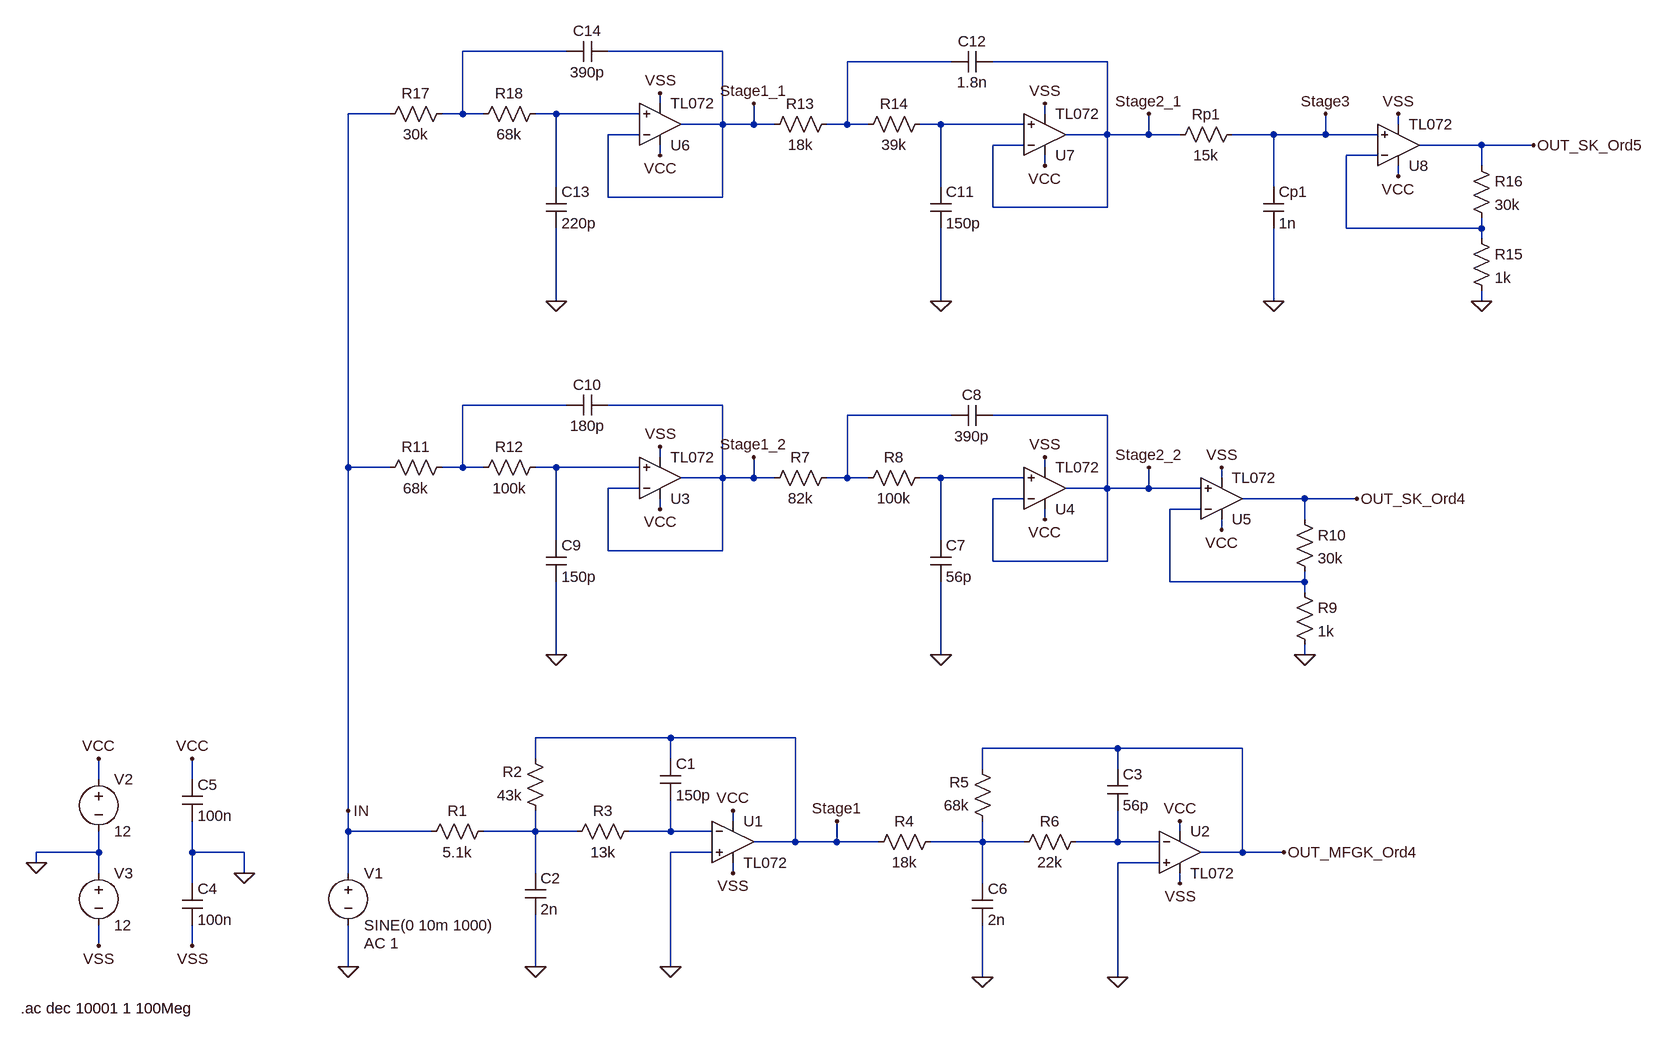
[diagram p0: schematic MFGK_SK_ordnung4_10kHz_1dB_30dB_butter.asc]
MFGK_SK_ordnung4_10kHz_1dB_30dB_butter.asc, the LTspice schematic file:
Version 4
SHEET 1 1784 736
WIRE 112 -928 -48 -928
WIRE 352 -928 176 -928
WIRE 704 -912 544 -912
WIRE 944 -912 768 -912
WIRE 256 -848 256 -864
WIRE -160 -832 -224 -832
WIRE -48 -832 -48 -928
WIRE -48 -832 -80 -832
WIRE -16 -832 -48 -832
WIRE 96 -832 64 -832
WIRE 224 -832 96 -832
WIRE 848 -832 848 -848
WIRE 352 -816 352 -928
WIRE 352 -816 288 -816
WIRE 400 -816 400 -848
WIRE 400 -816 352 -816
WIRE 432 -816 400 -816
WIRE 544 -816 544 -912
WIRE 544 -816 512 -816
WIRE 576 -816 544 -816
WIRE 688 -816 656 -816
WIRE 816 -816 688 -816
WIRE 1392 -816 1392 -832
WIRE 224 -800 176 -800
WIRE 944 -800 944 -912
WIRE 944 -800 880 -800
WIRE 1008 -800 1008 -832
WIRE 1008 -800 944 -800
WIRE 1056 -800 1008 -800
WIRE 1200 -800 1136 -800
WIRE 1280 -800 1280 -832
WIRE 1280 -800 1200 -800
WIRE 1360 -800 1280 -800
WIRE 816 -784 768 -784
WIRE 1520 -784 1424 -784
WIRE 1600 -784 1520 -784
WIRE 256 -768 256 -784
WIRE 1360 -768 1312 -768
WIRE 848 -752 848 -768
WIRE 1520 -752 1520 -784
WIRE 1392 -736 1392 -752
WIRE 96 -720 96 -832
WIRE 688 -720 688 -816
WIRE 1200 -720 1200 -800
WIRE 176 -704 176 -800
WIRE 352 -704 352 -816
WIRE 352 -704 176 -704
WIRE 768 -688 768 -784
WIRE 944 -688 944 -800
WIRE 944 -688 768 -688
WIRE 1312 -656 1312 -768
WIRE 1520 -656 1520 -672
WIRE 1520 -656 1312 -656
WIRE 1520 -640 1520 -656
WIRE 96 -544 96 -656
WIRE 688 -544 688 -656
WIRE 1200 -544 1200 -656
WIRE 1520 -544 1520 -560
WIRE 112 -384 -48 -384
WIRE 352 -384 176 -384
WIRE 704 -368 544 -368
WIRE 944 -368 768 -368
WIRE 256 -304 256 -320
WIRE -224 -288 -224 -832
WIRE -160 -288 -224 -288
WIRE -48 -288 -48 -384
WIRE -48 -288 -80 -288
WIRE -16 -288 -48 -288
WIRE 96 -288 64 -288
WIRE 224 -288 96 -288
WIRE 848 -288 848 -304
WIRE 352 -272 352 -384
WIRE 352 -272 288 -272
WIRE 400 -272 400 -304
WIRE 400 -272 352 -272
WIRE 432 -272 400 -272
WIRE 544 -272 544 -368
WIRE 544 -272 512 -272
WIRE 576 -272 544 -272
WIRE 688 -272 656 -272
WIRE 816 -272 688 -272
WIRE 1120 -272 1120 -288
WIRE 224 -256 176 -256
WIRE 944 -256 944 -368
WIRE 944 -256 880 -256
WIRE 1008 -256 1008 -288
WIRE 1008 -256 944 -256
WIRE 1088 -256 1008 -256
WIRE 816 -240 768 -240
WIRE 1248 -240 1152 -240
WIRE 1328 -240 1248 -240
WIRE 256 -224 256 -240
WIRE 1088 -224 1040 -224
WIRE 848 -208 848 -224
WIRE 1248 -208 1248 -240
WIRE 1120 -192 1120 -208
WIRE 96 -176 96 -288
WIRE 688 -176 688 -272
WIRE 176 -160 176 -256
WIRE 352 -160 352 -272
WIRE 352 -160 176 -160
WIRE 768 -144 768 -240
WIRE 944 -144 944 -256
WIRE 944 -144 768 -144
WIRE 1040 -112 1040 -224
WIRE 1248 -112 1248 -128
WIRE 1248 -112 1040 -112
WIRE 1248 -96 1248 -112
WIRE 96 0 96 -112
WIRE 688 0 688 -112
WIRE 1248 0 1248 -16
WIRE 272 128 64 128
WIRE 464 128 272 128
WIRE 960 144 752 144
WIRE 1152 144 960 144
WIRE 64 160 64 128
WIRE 272 160 272 128
WIRE 752 176 752 144
WIRE 960 176 960 144
WIRE -608 192 -608 160
WIRE -464 192 -464 160
WIRE -224 240 -224 -288
WIRE 368 256 368 240
WIRE -224 272 -224 240
WIRE -96 272 -224 272
WIRE 64 272 64 240
WIRE 64 272 -16 272
WIRE 128 272 64 272
WIRE 272 272 272 224
WIRE 272 272 208 272
WIRE 336 272 272 272
WIRE 1056 272 1056 256
WIRE 464 288 464 128
WIRE 464 288 400 288
WIRE 528 288 528 256
WIRE 528 288 464 288
WIRE 592 288 528 288
WIRE 752 288 752 256
WIRE 752 288 672 288
WIRE 816 288 752 288
WIRE 960 288 960 240
WIRE 960 288 896 288
WIRE 1024 288 960 288
WIRE -608 304 -608 272
WIRE -608 304 -704 304
WIRE -464 304 -464 256
WIRE -384 304 -464 304
WIRE 336 304 272 304
WIRE 1152 304 1152 144
WIRE 1152 304 1088 304
WIRE 1216 304 1152 304
WIRE -704 320 -704 304
WIRE 1024 320 960 320
WIRE -608 336 -608 304
WIRE -384 336 -384 304
WIRE -224 336 -224 272
WIRE 64 336 64 272
WIRE 368 336 368 320
WIRE -464 352 -464 304
WIRE 752 352 752 288
WIRE 1056 352 1056 336
WIRE -608 448 -608 416
WIRE -464 448 -464 416
WIRE -224 480 -224 416
WIRE 64 480 64 400
WIRE 272 480 272 304
WIRE 752 496 752 416
WIRE 960 496 960 320
FLAG -608 160 VCC
FLAG -608 448 VSS
FLAG -704 320 0
FLAG -464 160 VCC
FLAG -464 448 VSS
FLAG -384 336 0
FLAG -224 480 0
FLAG -224 240 IN
FLAG 1248 0 0
FLAG 688 0 0
FLAG 96 0 0
FLAG 256 -320 VSS
FLAG 848 -304 VSS
FLAG 1120 -288 VSS
FLAG 256 -224 VCC
FLAG 848 -208 VCC
FLAG 1120 -192 VCC
FLAG 1328 -240 OUT_SK_Ord4
FLAG 1008 -288 Stage2_2
FLAG 400 -304 Stage1_2
FLAG 1520 -544 0
FLAG 688 -544 0
FLAG 96 -544 0
FLAG 256 -864 VSS
FLAG 848 -848 VSS
FLAG 1392 -832 VSS
FLAG 256 -768 VCC
FLAG 848 -752 VCC
FLAG 1392 -736 VCC
FLAG 1600 -784 OUT_SK_Ord5
FLAG 1008 -832 Stage2_1
FLAG 400 -848 Stage1_1
FLAG 1200 -544 0
FLAG 1280 -832 Stage3
FLAG 368 240 VCC
FLAG 368 336 VSS
FLAG 272 480 0
FLAG 64 480 0
FLAG 528 256 Stage1
FLAG 1056 256 VCC
FLAG 1056 352 VSS
FLAG 960 496 0
FLAG 752 496 0
FLAG 1216 304 OUT_MFGK_Ord4
SYMBOL voltage -224 320 R0
WINDOW 123 24 124 Left 2
WINDOW 39 0 0 Left 0
SYMATTR Value2 AC 1
SYMATTR InstName V1
SYMATTR Value SINE(0 10m 1000)
SYMBOL voltage -608 176 R0
WINDOW 123 0 0 Left 0
WINDOW 39 0 0 Left 0
SYMATTR InstName V2
SYMATTR Value 12
SYMBOL voltage -608 320 R0
WINDOW 123 0 0 Left 0
WINDOW 39 0 0 Left 0
SYMATTR InstName V3
SYMATTR Value 12
SYMBOL cap -480 192 R0
SYMATTR InstName C5
SYMATTR Value 100n
SYMBOL cap -480 352 R0
SYMATTR InstName C4
SYMATTR Value 100n
SYMBOL res 528 -288 R90
WINDOW 0 0 56 VBottom 2
WINDOW 3 32 56 VTop 2
SYMATTR InstName R7
SYMATTR Value 82k
SYMBOL res 672 -288 R90
WINDOW 0 0 56 VBottom 2
WINDOW 3 32 56 VTop 2
SYMATTR InstName R8
SYMATTR Value 100k
SYMBOL res 1232 -112 R0
SYMATTR InstName R9
SYMATTR Value 1k
SYMBOL res 1232 -224 R0
SYMATTR InstName R10
SYMATTR Value 30k
SYMBOL cap 672 -176 R0
SYMATTR InstName C7
SYMATTR Value 56p
SYMBOL cap 768 -384 R90
WINDOW 0 0 32 VBottom 2
WINDOW 3 32 32 VTop 2
SYMATTR InstName C8
SYMATTR Value 390p
SYMBOL res -64 -304 R90
WINDOW 0 0 56 VBottom 2
WINDOW 3 32 56 VTop 2
SYMATTR InstName R11
SYMATTR Value 68k
SYMBOL res 80 -304 R90
WINDOW 0 0 56 VBottom 2
WINDOW 3 32 56 VTop 2
SYMATTR InstName R12
SYMATTR Value 100k
SYMBOL cap 80 -176 R0
SYMATTR InstName C9
SYMATTR Value 150p
SYMBOL cap 176 -400 R90
WINDOW 0 0 32 VBottom 2
WINDOW 3 32 32 VTop 2
SYMATTR InstName C10
SYMATTR Value 180p
SYMBOL TL072 256 -208 M180
SYMATTR InstName U3
SYMBOL TL072 848 -192 M180
SYMATTR InstName U4
SYMBOL TL072 1120 -176 M180
SYMATTR InstName U5
SYMBOL res 528 -832 R90
WINDOW 0 0 56 VBottom 2
WINDOW 3 32 56 VTop 2
SYMATTR InstName R13
SYMATTR Value 18k
SYMBOL res 672 -832 R90
WINDOW 0 0 56 VBottom 2
WINDOW 3 32 56 VTop 2
SYMATTR InstName R14
SYMATTR Value 39k
SYMBOL res 1504 -656 R0
SYMATTR InstName R15
SYMATTR Value 1k
SYMBOL res 1504 -768 R0
SYMATTR InstName R16
SYMATTR Value 30k
SYMBOL cap 672 -720 R0
SYMATTR InstName C11
SYMATTR Value 150p
SYMBOL cap 768 -928 R90
WINDOW 0 0 32 VBottom 2
WINDOW 3 32 32 VTop 2
SYMATTR InstName C12
SYMATTR Value 1.8n
SYMBOL res -64 -848 R90
WINDOW 0 0 56 VBottom 2
WINDOW 3 32 56 VTop 2
SYMATTR InstName R17
SYMATTR Value 30k
SYMBOL res 80 -848 R90
WINDOW 0 0 56 VBottom 2
WINDOW 3 32 56 VTop 2
SYMATTR InstName R18
SYMATTR Value 68k
SYMBOL cap 80 -720 R0
SYMATTR InstName C13
SYMATTR Value 220p
SYMBOL cap 176 -944 R90
WINDOW 0 0 32 VBottom 2
WINDOW 3 32 32 VTop 2
SYMATTR InstName C14
SYMATTR Value 390p
SYMBOL TL072 256 -752 M180
SYMATTR InstName U6
SYMBOL TL072 848 -736 M180
SYMATTR InstName U7
SYMBOL TL072 1392 -720 M180
SYMATTR InstName U8
SYMBOL res 1152 -816 R90
WINDOW 0 0 56 VBottom 2
WINDOW 3 32 56 VTop 2
SYMATTR InstName Rp1
SYMATTR Value 15k
SYMBOL cap 1184 -720 R0
SYMATTR InstName Cp1
SYMATTR Value 1n
SYMBOL res 0 256 R90
WINDOW 0 0 56 VBottom 2
WINDOW 3 32 56 VTop 2
SYMATTR InstName R1
SYMATTR Value 5.1k
SYMBOL res 80 256 R180
WINDOW 0 36 76 Left 2
WINDOW 3 36 40 Left 2
SYMATTR InstName R2
SYMATTR Value 43k
SYMBOL res 112 288 R270
WINDOW 0 32 56 VTop 2
WINDOW 3 0 56 VBottom 2
SYMATTR InstName R3
SYMATTR Value 13k
SYMBOL cap 256 160 R0
SYMATTR InstName C1
SYMATTR Value 150p
SYMBOL cap 48 336 R0
SYMATTR InstName C2
SYMATTR Value 2n
SYMBOL TL072 368 224 R0
SYMATTR InstName U1
SYMBOL res 688 272 R90
WINDOW 0 0 56 VBottom 2
WINDOW 3 32 56 VTop 2
SYMATTR InstName R4
SYMATTR Value 18k
SYMBOL res 768 272 R180
WINDOW 0 36 76 Left 2
WINDOW 3 36 40 Left 2
SYMATTR InstName R5
SYMATTR Value 68k
SYMBOL res 800 304 R270
WINDOW 0 32 56 VTop 2
WINDOW 3 0 56 VBottom 2
SYMATTR InstName R6
SYMATTR Value 22k
SYMBOL cap 944 176 R0
SYMATTR InstName C3
SYMATTR Value 56p
SYMBOL cap 736 352 R0
SYMATTR InstName C6
SYMATTR Value 2n
SYMBOL TL072 1056 240 R0
SYMATTR InstName U2
TEXT -728 544 Left 2 !.ac dec 10001 1 100Meg

The netlist it stands for:
* MFGK_SK_ordnung4_10kHz_1dB_30dB_butter.asc
V1 IN 0 SINE(0 10m 1000) AC 1
V2 VCC 0 12
V3 0 VSS 12
C5 VCC 0 100n
C4 0 VSS 100n
R7 N007 Stage1_2 82k
R8 N009 N007 100k
R9 N010 0 1k
R10 OUT_SK_Ord4 N010 30k
C7 N009 0 56p
C8 Stage2_2 N007 390p
R11 N006 IN 68k
R12 N008 N006 100k
C9 N008 0 150p
C10 Stage1_2 N006 180p
* U3: TL072 (symbol TL072 not available, pins judged from their places): In+=N008 In-=Stage1_2 V+=VCC V-=VSS OUT=Stage1_2
* U4: TL072 (symbol TL072 not available, pins judged from their places): In+=N009 In-=Stage2_2 V+=VCC V-=VSS OUT=Stage2_2
* U5: TL072 (symbol TL072 not available, pins judged from their places): In+=Stage2_2 In-=N010 V+=VCC V-=VSS OUT=OUT_SK_Ord4
R13 N002 Stage1_1 18k
R14 N004 N002 39k
R15 N005 0 1k
R16 OUT_SK_Ord5 N005 30k
C11 N004 0 150p
C12 Stage2_1 N002 1.8n
R17 N001 IN 30k
R18 N003 N001 68k
C13 N003 0 220p
C14 Stage1_1 N001 390p
* U6: TL072 (symbol TL072 not available, pins judged from their places): In+=N003 In-=Stage1_1 V+=VCC V-=VSS OUT=Stage1_1
* U7: TL072 (symbol TL072 not available, pins judged from their places): In+=N004 In-=Stage2_1 V+=VCC V-=VSS OUT=Stage2_1
* U8: TL072 (symbol TL072 not available, pins judged from their places): In+=Stage3 In-=N005 V+=VCC V-=VSS OUT=OUT_SK_Ord5
Rp1 Stage3 Stage2_1 15k
Cp1 Stage3 0 1n
R1 N011 IN 5.1k
R2 N011 Stage1 43k
R3 N011 N012 13k
C1 Stage1 N012 150p
C2 N011 0 2n
* U1: TL072 (symbol TL072 not available, pins judged from their places): In+=0 In-=N012 V+=VCC V-=VSS OUT=Stage1
R4 N013 Stage1 18k
R5 N013 OUT_MFGK_Ord4 68k
R6 N013 N014 22k
C3 OUT_MFGK_Ord4 N014 56p
C6 N013 0 2n
* U2: TL072 (symbol TL072 not available, pins judged from their places): In+=0 In-=N014 V+=VCC V-=VSS OUT=OUT_MFGK_Ord4
.ac dec 10001 1 100Meg
.backanno
.end